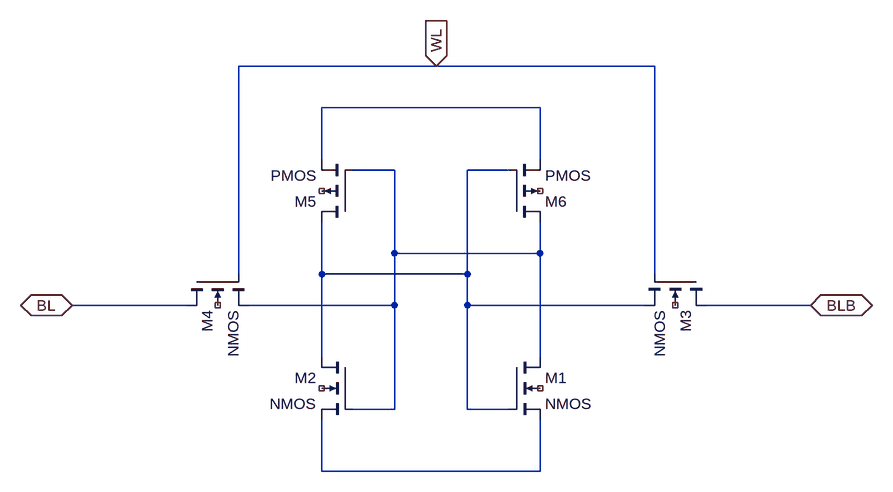
[diagram p0: schematic MCB.asc]
MCB.asc, the LTspice schematic file:
Version 4
SHEET 1 880 680
WIRE 96 -272 -208 -272
WIRE 432 -272 96 -272
WIRE 256 -208 -80 -208
WIRE -80 -128 -80 -208
WIRE 256 -128 256 -208
WIRE 32 -112 -32 -112
WIRE 208 -112 144 -112
WIRE 32 16 32 -112
WIRE 256 16 256 -32
WIRE 256 16 32 16
WIRE -208 48 -208 -272
WIRE -80 48 -80 -32
WIRE 144 48 144 -112
WIRE 144 48 -80 48
WIRE 432 48 432 -272
WIRE -288 96 -464 96
WIRE 32 96 32 16
WIRE 32 96 -192 96
WIRE 144 96 144 48
WIRE 416 96 144 96
WIRE 672 96 512 96
WIRE -80 176 -80 48
WIRE 256 176 256 16
WIRE 32 256 32 96
WIRE 32 256 -32 256
WIRE 144 256 144 96
WIRE 208 256 144 256
WIRE -80 352 -80 272
WIRE 256 352 256 272
WIRE 256 352 -80 352
FLAG -464 96 BL
IOPIN -464 96 BiDir
FLAG 672 96 BLB
IOPIN 672 96 BiDir
FLAG 96 -272 WL
IOPIN 96 -272 In
SYMBOL nmos4 208 176 R0
SYMATTR InstName M1
SYMBOL nmos4 -32 176 M0
SYMATTR InstName M2
SYMBOL nmos4 512 48 R90
SYMATTR InstName M3
SYMBOL nmos4 -288 48 M90
SYMATTR InstName M4
SYMBOL pmos4 -32 -32 R180
SYMATTR InstName M5
SYMBOL pmos4 208 -32 M180
SYMATTR InstName M6

The netlist it stands for:
* MCB.asc
M1 N002 N003 N004 NC_01 NMOS
M2 N003 N002 N004 NC_02 NMOS
M3 BLB WL N003 NC_03 NMOS
M4 BL WL N002 NC_04 NMOS
M5 N003 N002 N001 NC_05 PMOS
M6 N002 N003 N001 NC_06 PMOS
.model NMOS NMOS
.model PMOS PMOS
.lib standard.mos
.backanno
.end